# Altium schematic sheet Power.SchDoc
size A; SheetNumber: 1; SheetTotal: 9
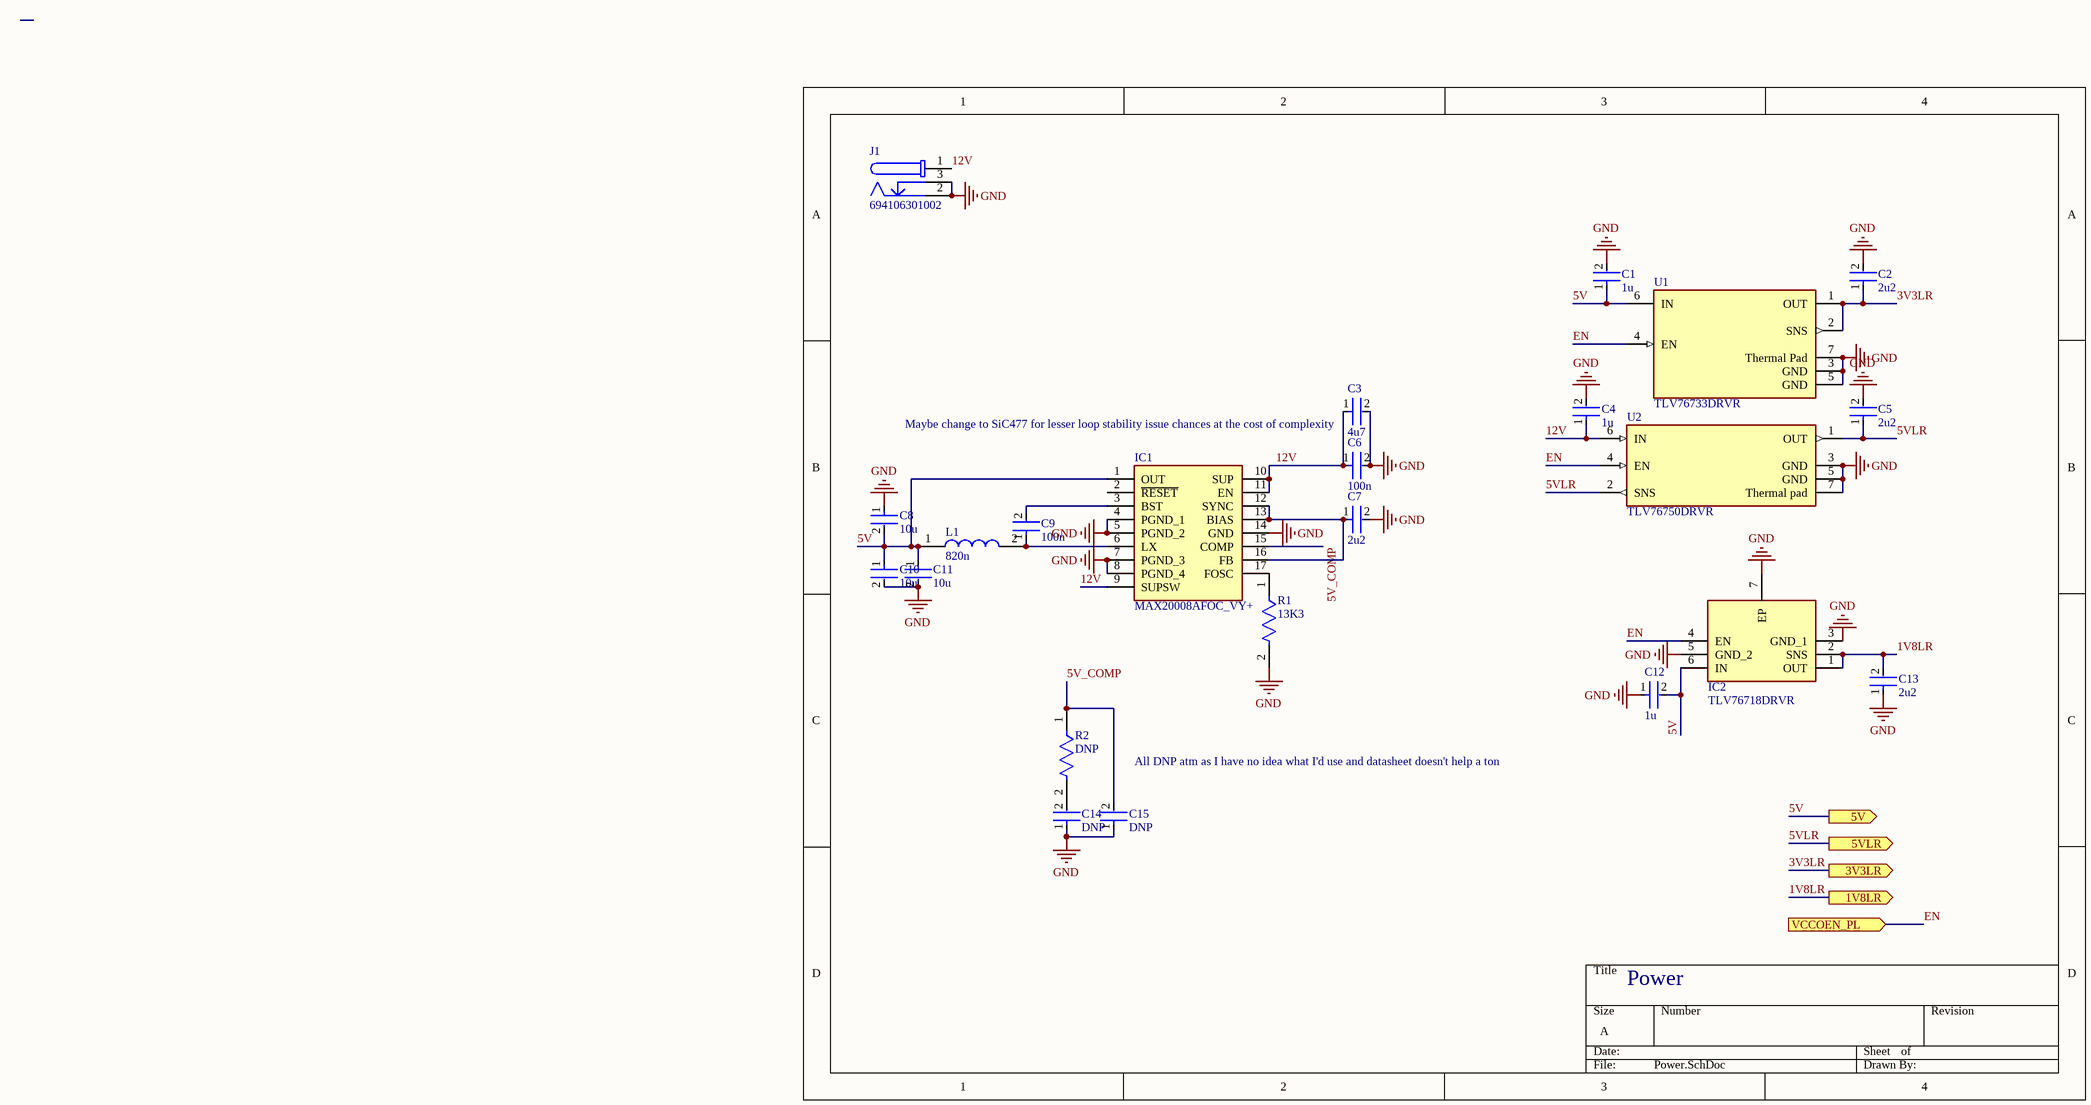
[diagram p0: Power.SchDoc]

## Parts
C1  1u  [FP-GRM155-0_1-MFG]
C2  2u2  [FP-GRM155-0_2-MFG]
C3  4u7  [FP-GRT188-0_2-IPC_A]
C4  1u  [FP-GRM155-0_1-MFG]
C5  2u2  [FP-GRM155-0_2-MFG]
C6  100n  [FP-GRM155-0_05-IPC_C]
C7  2u2  [FP-GRM155-0_2-MFG]
C8  10u  [FP-GRM188-0_2-IPC_B]
C9  100n  [FP-GRM155-0_05-IPC_C]
C10  10u  [FP-GRM188-0_2-IPC_B]
C11  10u  [FP-GRM188-0_2-IPC_B]
C12  1u  [FP-GRM155-0_1-MFG]
C13  2u2  [FP-GRM155-0_2-MFG]
C14  DNP  [FP-GRM155-0_05-IPC_C]  (no BOM)
C15  DNP  [FP-GRM155-0_05-IPC_C]  (no BOM)
IC1  MAX20008AFOC_VY+  [MAX20008AFOCVY]
IC2  TLV76718DRVR  [SON65P200X200X80-7N]
J1  694106301002  [694106301002]
L1  820n  [INDPM7166X300N]
R1  13K3  [FP-AC0402-IPC_B]
R2  DNP  [FP-AC0402-IPC_B]  (no BOM)
U1  TLV76733DRVR  [FP-DRV0006A-IPC_C]
U2  TLV76750DRVR  [FP-DRV0006A-IPC_B]

## Ports
1V8LR (out), 3V3LR (out), 5V (out), 5VLR (out), VCCOEN_PL (in)

## Nets
GND: C1.2 C2.2 C3.2 C4.2 C5.2 C6.2 C7.2 C8.1 C10.2 C11.2 C12.1 C13.1 C14.1 C15.1 IC1.4(PGND_1) IC1.5(PGND_2) IC1.7(PGND_3) IC1.8(PGND_4) IC1.14(GND) IC2.3(GND_1) IC2.5(GND_2) IC2.7(EP) J1.2 J1.3 R1.2 U1.3(GND) U1.5(GND) U1.7(Thermal_Pad) U2.3(GND) U2.5(GND) U2.7(Thermal_pad)
1V8LR: C13.2 IC2.1(OUT) IC2.2(SNS) ; port 1V8LR
3V3LR: C2.1 U1.1(OUT) U1.2(SNS) ; port 3V3LR
5V: C1.1 C8.2 C10.1 C11.1 C12.2 IC1.1(OUT) IC2.6(IN) L1.1 U1.6(IN) ; port 5V
5V_COMP: C15.2 IC1.15(COMP) R2.1
5VLR: C5.1 U2.1(OUT) U2.2(SNS) ; port 5VLR
12V: C3.1 C4.1 C6.1 IC1.9(SUPSW) IC1.10(SUP) IC1.11(EN) J1.1 U2.6(IN)
EN: IC2.4(EN) U1.4(EN) U2.4(EN) ; port VCCOEN_PL
NetC7_1: C7.1 IC1.12(SYNC) IC1.13(BIAS) IC1.16(FB)
NetC9_1: C9.1 IC1.6(LX) L1.2
NetC9_2: C9.2 IC1.3(BST)
NetC14_2: C14.2 R2.2
NetIC1_17: IC1.17(FOSC) R1.1

Not connected (* = marked no-connect by the designer): IC1 2(~{RESET})

## Notes on the sheet
- (near C3) Maybe change to SiC477 for lesser loop stability issue chances at the cost of complexity
- All DNP atm as I have no idea what I'd use and datasheet doesn't help a ton
- Power

## Library data of the parts
C1 C4 C12 = CMP-06035-041084-1: Chip Multilayer Ceramic Capacitors for General Purpose, 0402, 1.0uF, X5R, 15%, 10%, 50V
C2 C5 C7 C13 = CMP-06035-031599-1: Chip Multilayer Ceramic Capacitors for General Purpose, 0402, 2.2uF, X5R, 15%, 10%, 35V; Case/Package: 0402
C3 = CMP-06035-045585-1: Multi-Layer Ceramic Capacitor 4.7uF 35V X5R ±10% 0603 Paper T/R
C6 C9 C14 C15 = CMP-06035-008289-1: Chip Multilayer Ceramic Capacitors for General Purpose, 0402, 0.10uF, X5R, 15%, 10%, 100V; Capacitance: 100nF; Case Code (Metric): 1005; Width: 0.5mm; Case/Package: 0402; Case Code (Imperial): 0402; Voltage Rating (DC): 100V; Package Quantity: 10000; Length: 0.039inch; Height: 0.5mm; Max Operating Temperature: 85°C; Lead Free: Lead Free; Termination: SMD/SMT; Mount: Surface Mount; Tolerance: 10%; Packaging: Tape and Reel; Voltage Rating: 100V; Thickness: 0.022inch; Dielectric: X5R; REACH SVHC: No SVHC; Min Operating Temperature: -55°C; Weight: 0.000212oz
C8 C10 C11 = CMP-06035-022879-1: Chip Multilayer Ceramic Capacitors for General Purpose, 0603, 10uF, X5R, 15%, 10%, 25V
IC1 = MAX20008AFOC_VY+: Integrated Circuit; Manufacturer_Name: Analog Devices; Manufacturer_Part_Number: MAX20008AFOC/VY+; Datasheet Link: https://www.analog.com/media/en/technical-documentation/data-sheets/MAX20004-MAX20008.pdf; Height: 0.75mm; Mouser Part Number: 700-MAX20008AFOC/VY+; Mouser Price/Stock: https://www.mouser.co.uk/ProductDetail/Analog-Devices-Maxim-Integrated/MAX20008AFOC-VY%2b?qs=gZXFycFWdAPYYhB%2FcA8TDQ%3D%3D; Arrow Part Number: MAX20008AFOC/VY+; Arrow Price/Stock: https://www.arrow.com/en/products/max20008afocvy/maxim-integrated?region=nac
IC2 = TLV76718DRVR: Integrated Circuit; Manufacturer_Name: Texas Instruments; Datasheet Link: http://www.ti.com/lit/gpn/TLV767; Height: 0.8mm; Manufacturer_Part_Number: TLV76718DRVR; Mouser Part Number: 595-TLV76718DRVR; Mouser Price/Stock: https://www.mouser.co.uk/ProductDetail/Texas-Instruments/TLV76718DRVR?qs=9r4v7xj2Lnk9Dlu7qdid6g%3D%3D; Arrow Part Number: TLV76718DRVR; Arrow Price/Stock: https://www.arrow.com/en/products/tlv76718drvr/texas-instruments?region=nac
J1 = CMP-1502-00188-2: NexarPartId: 52676100; Voltage Rating (DC): 20V; Gender: Male; Voltage Rating: 24V; Connector Type: Power; Insulation Resistance: 100MΩ; Current Rating: 5A; Shielding: Unshielded; Number of Contacts: 3; Color: Black; Housing Material: Polyamide; Contact Gender: Female; REACH SVHC: Unknown; Termination: Through Hole; Height: 11mm; RoHS: Compliant; Mount: Through Hole; Flammability Rating: UL94 V-0; Packaging: Bulk; Min Operating Temperature: -40°C; Contact Plating: Tin; Max Operating Temperature: 85°C; Operating Supply Voltage: 24V; Contact Material: Gold, Tin
L1 = ECS-MPIL0630-R82MC: Inductor; Manufacturer_Name: ECS; Datasheet Link: https://www.arrow.com/en/products/ecs-mpil0630-r82mc/ecs-international; Height: 3mm; Manufacturer_Part_Number: ECS-MPIL0630-R82MC; Mouser Part Number: 520-MPIL0630-R82MC; Mouser Price/Stock: https://www.mouser.co.uk/ProductDetail/ECS/ECS-MPIL0630-R82MC?qs=wd5RIQLrsJhh%2FAGpWz2Oog%3D%3D; Arrow Part Number: ECS-MPIL0630-R82MC; Arrow Price/Stock: https://www.arrow.com/en/products/ecs-mpil0630-r82mc/ecs-international
R1 R2 = CMP-03412-003052-2: RES 13.3kΩ ±1% 0.063W 0402; Resistance: 13.3kR; Power Rating: 62.5mW; Max Power Dissipation: 63mW; Voltage Rating: 50V; Temperature Coefficient: 100ppm/°C; Series: AC; Width: 0.5mm; Number of Terminations: 2; Features: Moisture Resistant; Packaging: Tape and Reel; Case Code (Imperial): 0402; Resistor Type: Thick Film; Case/Package: 0402; Length: 0.039inch; RoHS Compliant: Yes; Tolerance: 1%; Case Code (Metric): 1005; Height: 0.015inch; Termination: SMD/SMT; Min Operating Temperature: -55°C; Max Operating Temperature: 155°C
U1 = CMP-04917-000203-1: VOLTAGE COMPARATOR
U2 = CMP-04917-000175-1: IC VREG LINEAR